# Altium schematic sheet PWM.SchDoc
size A4; SheetNumber: 5; SheetTotal: 6
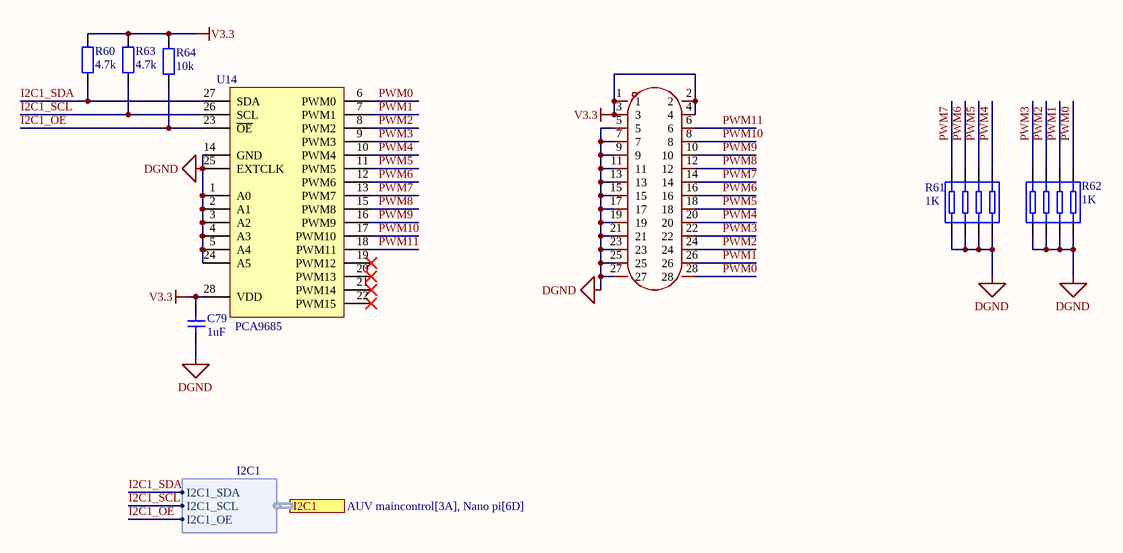
[diagram p0: PWM.SchDoc]

## Parts
C79  1uF  [0603_C]
R60  4.7k  [0603R]
R61  1K  [res-4]
R62  1K  [res-4]
R63  4.7k  [0603R]
R64  10k  [0603R]
U14  PCA9685  [TSSOP-28]
U15  XDFH-0254-2*14P  [CONN-TH_28P-P2.54_LX_XDFH-0254-2X14P]  (value not drawn)

## Ports
I2C1 (harness I2C1, see AUV maincontrol[3A], Nano pi[6D])

## Harnesses
I2C1: I2C1_SDA, I2C1_SCL, I2C1_OE

## Nets
DGND: C79.1 R61.1 R61.2 R61.3 R61.4 R62.1 R62.2 R62.3 R62.4 U14.1(A0) U14.2(A1) U14.3(A2) U14.4(A3) U14.5(A4) U14.14(GND) U14.24(A5) U14.25(EXTCLK) U15.5 U15.7 U15.9 U15.11 U15.13 U15.15 U15.17 U15.19 U15.21 U15.23 U15.25 U15.27
V3.3: C79.2 R60.2 R63.2 R64.2 U14.28(VDD) U15.1 U15.2 U15.3 U15.4
I2C1_OE: R64.1 U14.23(~{OE}) ; port I2C1.I2C1_OE
I2C1_SCL: R63.1 U14.26(SCL) ; port I2C1.I2C1_SCL
I2C1_SDA: R60.1 U14.27(SDA) ; port I2C1.I2C1_SDA
PWM0: R62.5 U14.6(PWM0) U15.28
PWM1: R62.6 U14.7(PWM1) U15.26
PWM2: R62.7 U14.8(PWM2) U15.24
PWM3: R62.8 U14.9(PWM3) U15.22
PWM4: R61.5 U14.10(PWM4) U15.20
PWM5: R61.6 U14.11(PWM5) U15.18
PWM6: R61.7 U14.12(PWM6) U15.16
PWM7: R61.8 U14.13(PWM7) U15.14
PWM8: U14.15(PWM8) U15.12
PWM9: U14.16(PWM9) U15.10
PWM10: U14.17(PWM10) U15.8
PWM11: U14.18(PWM11) U15.6

Not connected (* = marked no-connect by the designer): U14 19(PWM12)* 20(PWM13)* 21(PWM14)* 22(PWM15)*

## Library data of the parts
C79 = Cap1: 无极贴片电容
R60 R63 R64 = Res: 电阻
R61 R62 = Res-4: 排阻
U15 = XDFH-0254-2*14P: Manufacturer: LX(连欣科技); Add into BOM: yes; Connector Type: 简牛座; Pitch: 2.54mm; Structure: 2x14P; Current Rating (Max): 3A; Voltage Rating (Max): 500V; Holder Type: 直插; Pin Number in each Row: 14; Soldering Temperature(Max): 260℃; Symbol: XDFH-0254- 2*14P; Device: XDFH-0254-2*14P; LCSC Part Name: 镀2U全金品质简牛插座PH2.54MM-2*14PIN直插板 DIP; Supplier Part: C19193813; Manufacturer Part: XDFH-0254-2*14P; Supplier Footprint: 插件,P=2.54mm; JLCPCB Part Class: Extended Part; Datasheet: https://atta.szlcsc.com/upload/public/pdf/source/20231117/B05B179C28F8598ADEE3EE3DBCADEC41.pdf; Supplier: LCSC; Convert to PCB: yes; Number of Rows: 2; Contact Material: 铜; Contact Plating: 金; Operating Temperature Range: -45℃~+105℃